# EAGLE design untitled (EAGLE 9.5.0)
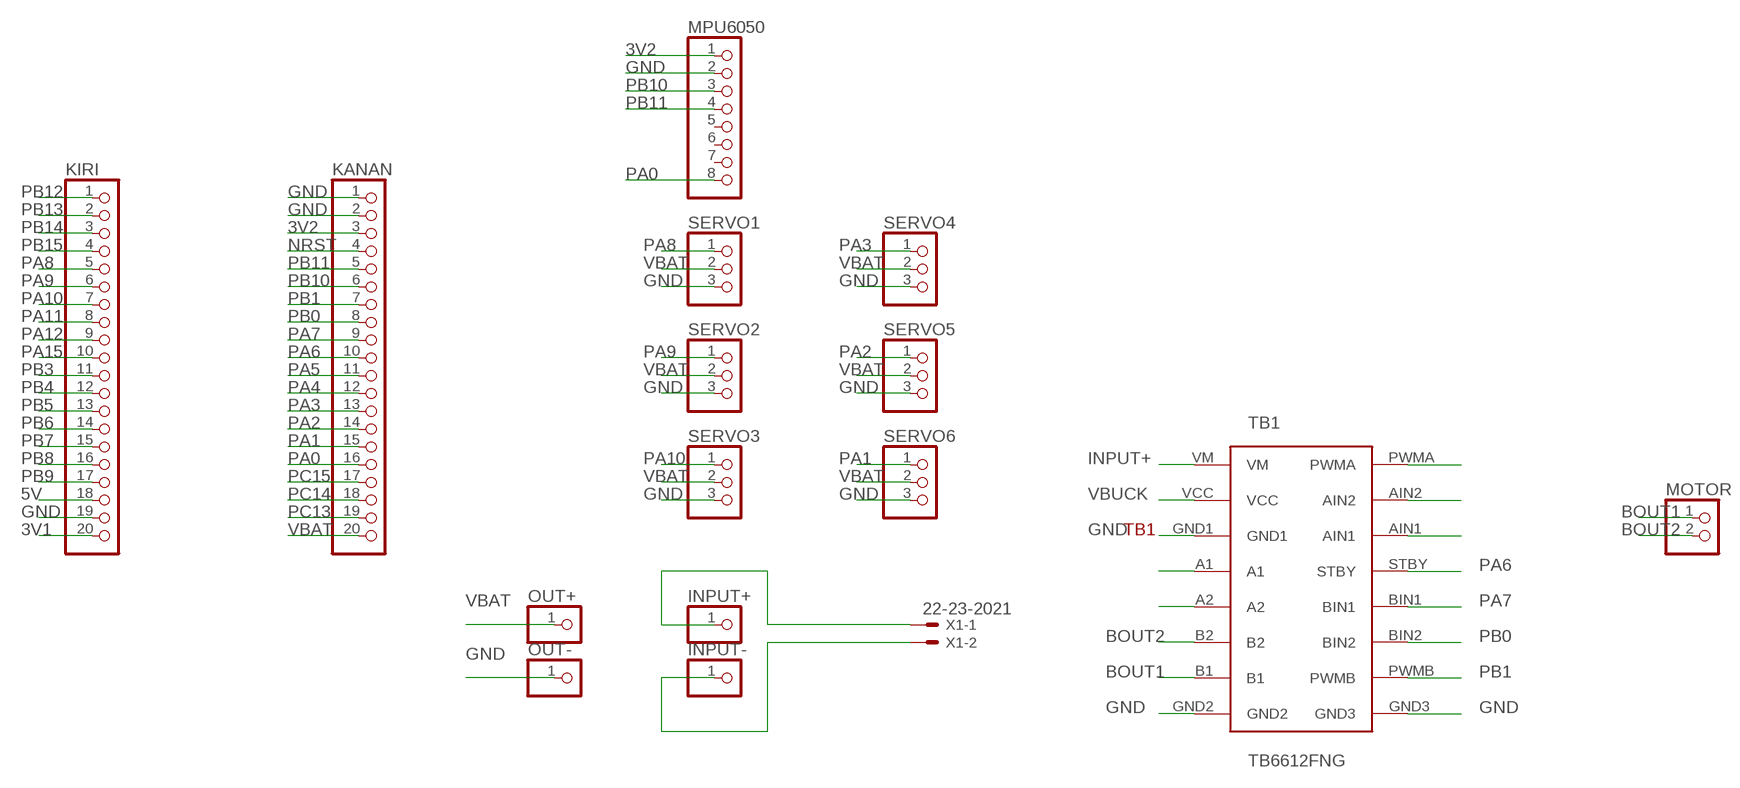
[diagram p0: schematic, sheet 1]

## Parts
INPUT+  PINHD-1X1  [1X01]
INPUT-  PINHD-1X1  [1X01]
KANAN  PINHD-1X20  [1X20]
KIRI  PINHD-1X20  [1X20]
MOTOR  PINHD-1X2  [1X02]
MPU6050  PINHD-1X8  [1X08]
OUT+  PINHD-1X1  [1X01]
OUT-  PINHD-1X1  [1X01]
SERVO1  PINHD-1X3  [1X03]
SERVO2  PINHD-1X3  [1X03]
SERVO3  PINHD-1X3  [1X03]
SERVO4  PINHD-1X3  [1X03]
SERVO5  PINHD-1X3  [1X03]
SERVO6  PINHD-1X3  [1X03]
TB1  TB6612FNG  [TB6612FNG]
X1  22-23-2021  [22-23-2021]

## Nets
3V1: KIRI.20
3V2: KANAN.3 MPU6050.1
5V: KIRI.18
BOUT1: MOTOR.1 TB1.B1
BOUT2: MOTOR.2 TB1.B2
GND: KANAN.1 KANAN.2 KIRI.19 MPU6050.2 OUT-.1 SERVO1.3 SERVO2.3 SERVO3.3 SERVO4.3 SERVO5.3 SERVO6.3 TB1.GND1 TB1.GND2 TB1.GND3
INPUT+: TB1.VM
N$3: INPUT+.1 X1.1
N$4: INPUT-.1 X1.2
N$6: TB1.A1
N$7: TB1.A2
N$11: TB1.PWMA
N$12: TB1.AIN2
N$13: TB1.AIN1
NRST: KANAN.4
PA0: KANAN.16 MPU6050.8
PA1: KANAN.15 SERVO6.1
PA2: KANAN.14 SERVO5.1
PA3: KANAN.13 SERVO4.1
PA4: KANAN.12
PA5: KANAN.11
PA6: KANAN.10 TB1.STBY
PA7: KANAN.9 TB1.BIN1
PA8: KIRI.5 SERVO1.1
PA9: KIRI.6 SERVO2.1
PA10: KIRI.7 SERVO3.1
PA11: KIRI.8
PA12: KIRI.9
PA15: KIRI.10
PB0: KANAN.8 TB1.BIN2
PB1: KANAN.7 TB1.PWMB
PB3: KIRI.11
PB4: KIRI.12
PB5: KIRI.13
PB6: KIRI.14
PB7: KIRI.15
PB8: KIRI.16
PB9: KIRI.17
PB10: KANAN.6 MPU6050.3
PB11: KANAN.5 MPU6050.4
PB12: KIRI.1
PB13: KIRI.2
PB14: KIRI.3
PB15: KIRI.4
PC13: KANAN.19
PC14: KANAN.18
PC15: KANAN.17
VBAT: KANAN.20 OUT+.1 SERVO1.2 SERVO2.2 SERVO3.2 SERVO4.2 SERVO5.2 SERVO6.2
VBUCK: TB1.VCC
Unconnected: MPU6050.5 MPU6050.6 MPU6050.7

## Library data of the parts
INPUT+ INPUT- OUT+ OUT- = pinhead:PINHD-1X1: PIN HEADER
KANAN KIRI = pinhead:PINHD-1X20: PIN HEADER
MOTOR = pinhead:PINHD-1X2: PIN HEADER
MPU6050 = pinhead:PINHD-1X8: PIN HEADER
SERVO1-SERVO6 = pinhead:PINHD-1X3: PIN HEADER
TB1 = TB6612FNG:TB6612FNG
X1 = con-molex:22-23-2021: .100" (2.54mm) Center Header - 2 Pin; MF: MOLEX; MPN: 22-23-2021; OC_FARNELL: 1462926; OC_NEWARK: 25C3832

## Board
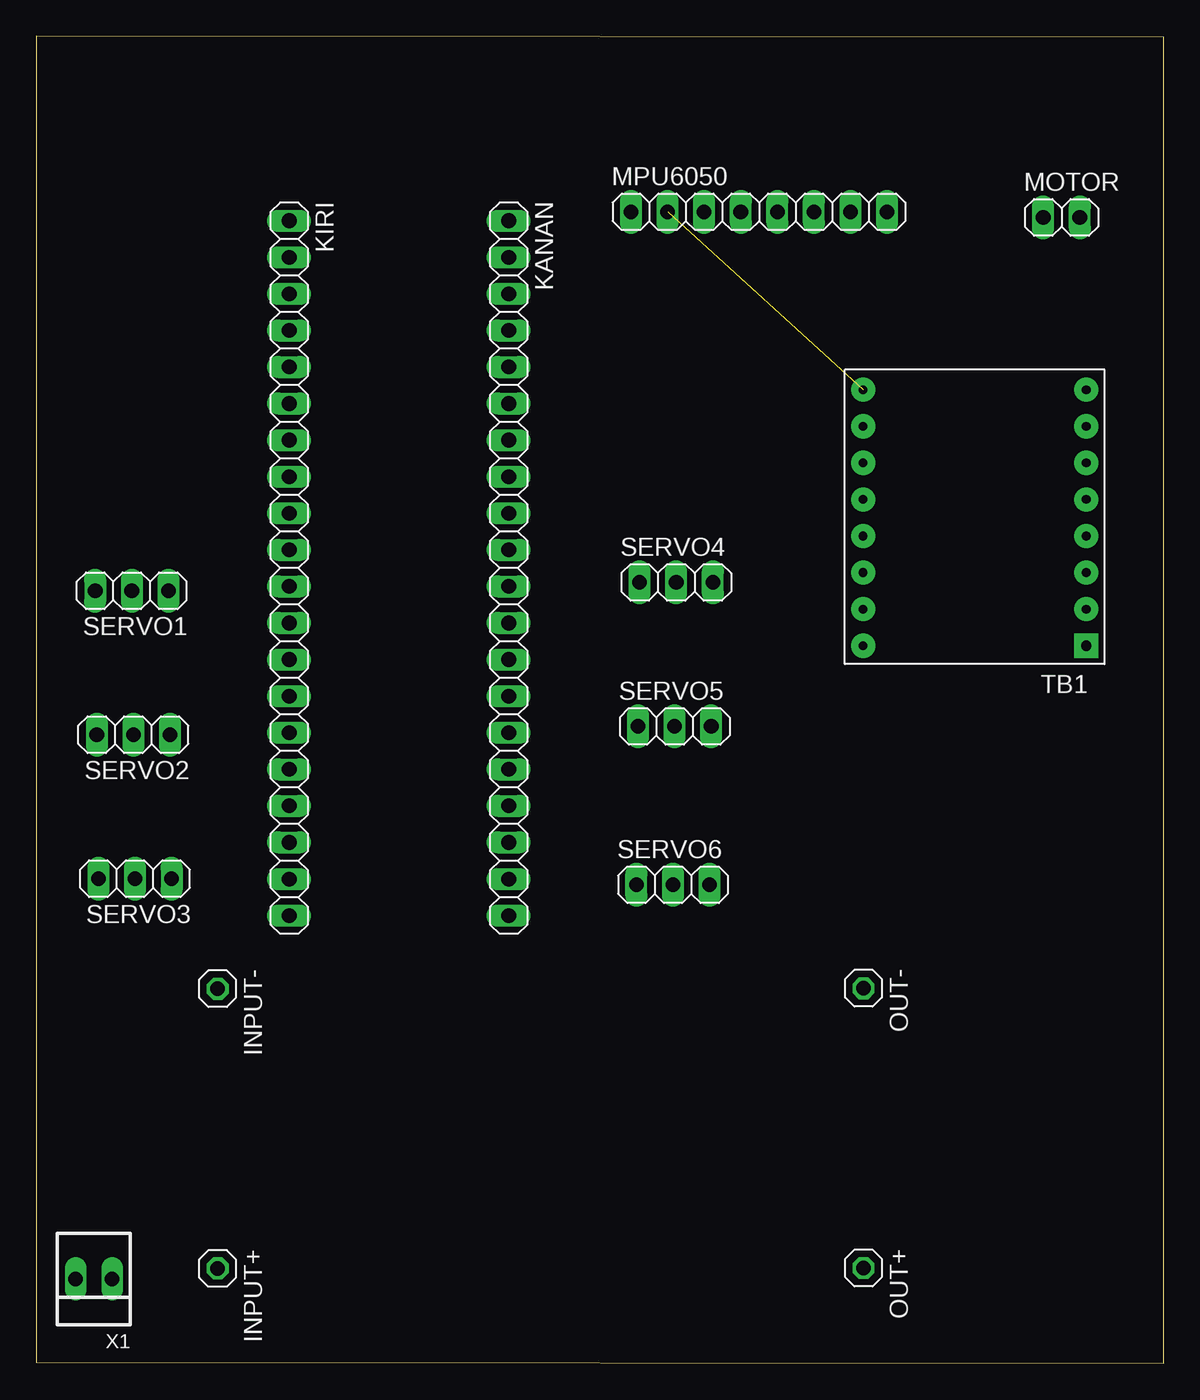
[diagram p1: board, top side]
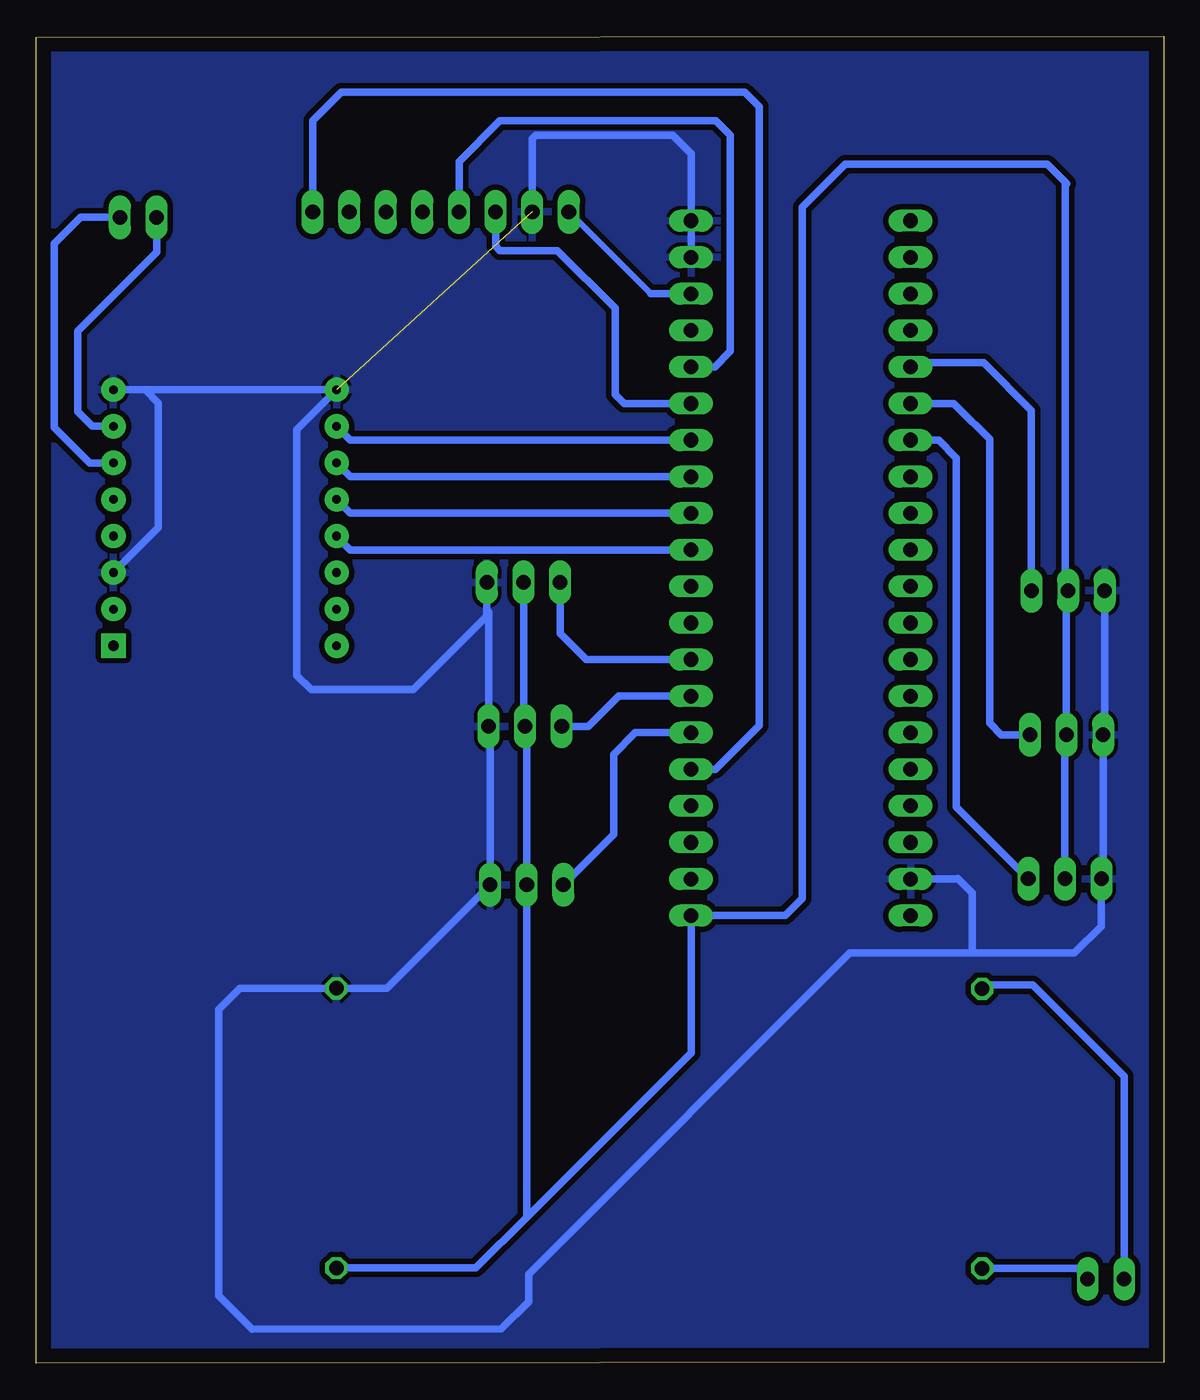
[diagram p2: board, bottom side, seen from below]

Size 78.3 x 92.2 mm. Coordinates in mm from the lower left corner, seen from the top.
Outline: 0,0.1 78.3,0 78.3,92.1 0,92.2 0,0.1
Copper layers (1*16): Top 0.035mm / dielectric 1.5mm / Bottom 0.035mm
Design rules "default *": minimum track width 6mil, minimum drill 0.35mm, track to track 15mil, track to pad 15mil, pad to pad 15mil, via to via 15mil, smd to smd 6mil, copper to edge 40mil, drill to drill 6mil, minimum pad ring 10mil, minimum via ring 8mil, stop-mask expansion 4mil, vias tented up to drill 0mil, thermal gap 10mil

### Footprints (pad centres in the part's own frame; a part is rotated, then mirrored left to right if it is on the bottom)
1X01 = drill 1.016 octagon: 1 0,0
1X20 = drill 1.016 long: 1 -24.13,0; 2 -21.59,0; 3 -19.05,0; 4 -16.51,0; 5 -13.97,0; 6 -11.43,0; 7 -8.89,0; 8 -6.35,0; 9 -3.81,0; 10 -1.27,0; 11 1.27,0; 12 3.81,0; 13 6.35,0; 14 8.89,0; 15 11.43,0; 16 13.97,0; 17 16.51,0; 18 19.05,0; 19 21.59,0; 20 24.13,0
1X02 = drill 1.016 long: 1 -1.27,0; 2 1.27,0
1X08 = drill 1.016 long: 1 -8.89,0; 2 -6.35,0; 3 -3.81,0; 4 -1.27,0; 5 1.27,0; 6 3.81,0; 7 6.35,0; 8 8.89,0
1X03 = drill 1.016 long: 1 -2.54,0; 2 0,0; 3 2.54,0
TB6612FNG = drill 0.6 pad 1.676: A1 -7.62,-1.27; A2 -7.62,-3.81; AIN1 7.874,1.27; AIN2 7.874,3.81; B1 -7.62,-8.89; B2 -7.62,-6.35; BIN1 7.874,-3.81; BIN2 7.874,-6.35; GND1 -7.62,1.27; GND2 -7.62,-11.43; GND3 7.874,-11.43; PWMA 7.874,6.35; PWMB 7.874,-8.89; STBY 7.874,-1.27; VCC -7.62,3.81 | drill 0.7 pad 1.676 square: VM -7.62,6.35
22-23-2021 = drill 1 long: 1 -1.27,0; 2 1.27,0

### Placement (x,y rotation side)
INPUT+  12.61,6.6 270 top
INPUT-  12.61,26.03 270 top
KANAN  32.82,55.24 270 top
KIRI  17.58,55.24 270 top
MOTOR  71.2,79.6 0 top
MPU6050  50.2,79.99 0 top
OUT+  57.45,6.63 270 top
OUT-  57.45,26.06 270 top
SERVO1  6.65,53.67 180 top
SERVO2  6.76,43.67 180 top
SERVO3  6.87,33.67 180 top
SERVO4  44.45,54.25 0 top
SERVO5  44.34,44.25 0 top
SERVO6  44.23,33.25 0 top
TB1  65.3,56.2 180 top
X1  4.02,5.88 180 top

### Tracks (layer width: path | path; a pad name or v marks a point on that pad's centre or on a via)
3V2
  Bottom 0.406: MPU6050.1 35.86,74.54 35.61,74.29
  Bottom 0.508: 35.61,74.29 KANAN.3
BOUT1
  Bottom 0.508: MOTOR.1 69.93,77.17 75.4,71.7 75.4,66.1 74.39,65.09 TB1.B1
BOUT2
  Bottom 0.508: TB1.B2 74.58,62.55 77.03,65 77.03,77.77 75.2,79.6 MOTOR.2
GND  (1 unrouted)
  Bottom 0.406: SERVO3.3 4.22,33.78 | SERVO2.3 4.22,43.6 4.11,43.71 | SERVO1.3 4.11,53.6 4,53.71 | 46.99,44.4 46.99,44.36 SERVO5.3 | 17.23,33.3 KIRI.19
  Bottom 0.508: KANAN.2 KANAN.1 32.82,84.02 34.1,85.3 43.6,85.3 43.85,85.05 MPU6050.2 | TB1.GND1 69.8,58.05 69.8,66.7 70.73,67.63 | 70.73,67.63 TB1.GND2 | 70.73,67.63 TB1.GND3 60.2,64.86 60.2,47.8 59.2,46.8 52.1,46.8 46.99,51.91 46.99,52.3 | 46.99,52.3 SERVO4.3 | 46.99,44.4 46.77,44.18 SERVO6.3 53.96,26.06 OUT-.1 64.14,26.06 65.6,24.6 65.6,4.69 63.3,2.39 45.99,2.41 44.1,4.3 44.1,6.2 21.8,28.5 13.3,28.5 | SERVO5.3 46.88,52.19 46.99,52.3 | SERVO1.3 4.11,43.71 | SERVO2.3 4.22,33.28 4.3,33.2 4.33,33.23 SERVO3.3 4.33,30.37 6.2,28.5 13.3,28.5 | KIRI.19 14.35,33.65 14.3,33.7 13.3,32.7 13.3,28.5
  pour Bottom: 0,92.2 78.2,92.2 78.5,91.9 78.5,0.3 78.2,0 0.1,0 0,-0.1
N$3
  Bottom 0.508: INPUT+.1 6.01,6.6 X1.1
N$4
  Bottom 0.508: X1.2 2.75,19.95 9.1,26.3 12.34,26.3 INPUT-.1
PA0
  Bottom 0.508: MPU6050.8 59.09,86.31 57.1,88.3 29.1,88.3 28.1,87.3 28.1,44.3 31.13,41.27 KANAN.16
PA1
  Bottom 0.508: SERVO6.1 38.2,36.74 38.2,42.3 36.69,43.81 KANAN.15
PA2
  Bottom 0.508: SERVO5.1 39.95,44.25 37.85,46.35 KANAN.14
PA3
  Bottom 0.508: KANAN.13 40.09,48.89 41.91,50.71 SERVO4.1
PA6
  Bottom 0.508: TB1.STBY 56.47,56.51 KANAN.10
PA7
  Bottom 0.508: TB1.BIN1 56.47,59.05 KANAN.9
PA8
  Bottom 0.508: SERVO1.1 9.19,66.19 12.5,69.5 17.29,69.5 KIRI.5
PA9
  Bottom 0.508: 17.21,66.3 KIRI.6 14.57,66.67 13.3,65.4 13.1,65.2 12.1,64.2 12.1,44.5 11.27,43.67 SERVO2.1
PA10
  Bottom 0.508: SERVO3.1 14.4,38.66 14.4,62.9 15.63,64.13 KIRI.7
PB0
  Bottom 0.508: TB1.BIN2 56.47,61.59 KANAN.8
PB1
  Bottom 0.508: TB1.PWMB 56.47,64.13 KANAN.7
PB10
  Bottom 0.508: KANAN.6 37.47,66.67 38.1,67.3 38.1,73.3 42.1,77.3 46.1,77.3 46.39,77.59 MPU6050.3
PB11
  Bottom 0.305: 32.73,69.3 KANAN.5
  Bottom 0.508: MPU6050.4 48.93,83.47 46.1,86.3 31.1,86.3 30.1,85.3 30.1,70.3 31.19,69.21 KANAN.5
VBAT
  Bottom 0.406: 6.65,43.78 SERVO2.2 | 6.76,33.78 SERVO3.2 | 44.45,44.4 44.45,44.36
  Bottom 0.508: OUT+.1 47.77,6.63 44.23,10.17 | 44.23,10.17 32.82,21.58 KANAN.20 26.29,31.11 25.1,32.3 25.1,80.3 22.1,83.3 8.1,83.3 6.85,82.05 | 6.75,81.95 6.85,82.05 | SERVO4.2 44.45,44.36 SERVO5.2 44.23,44.14 SERVO6.2 44.23,10.17 | 6.85,82.05 6.85,53.87 6.76,53.78 | 6.76,53.78 SERVO1.2 | 6.76,53.78 SERVO2.2 6.87,43.56 SERVO3.2